# EasyEDA Pro project 毕设.eprj, board PCB1
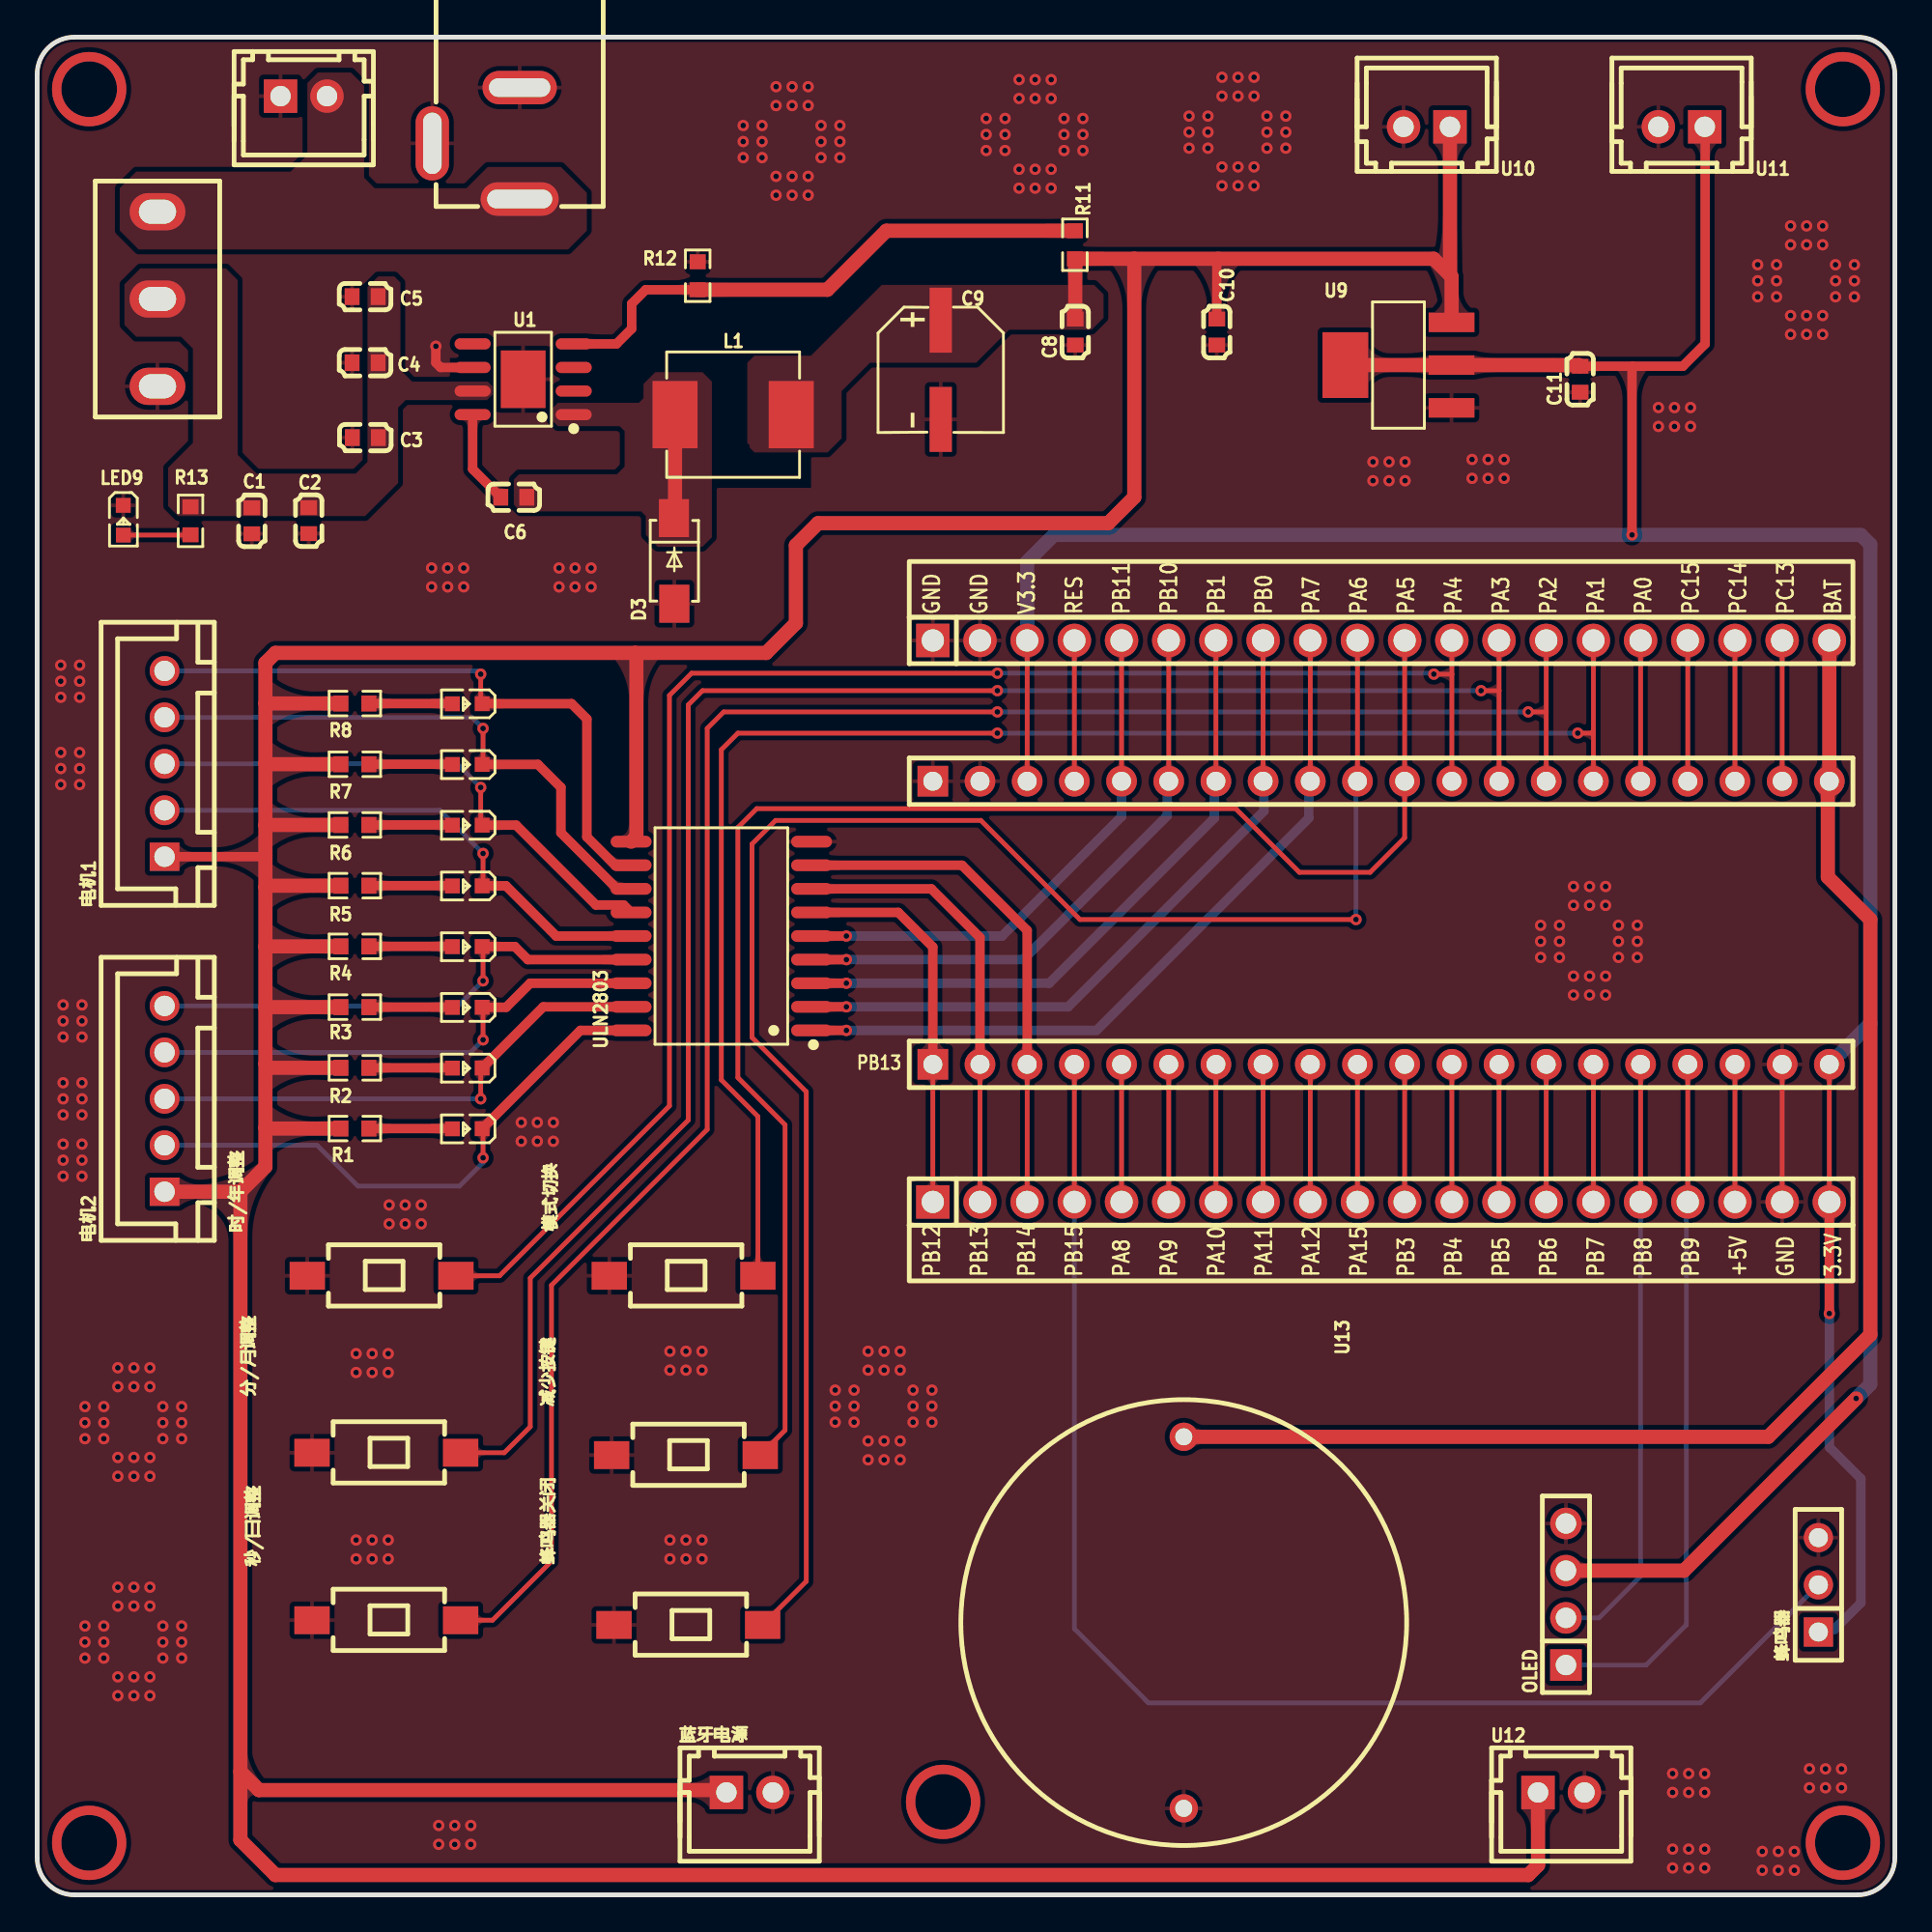
[diagram p1: board, top side]
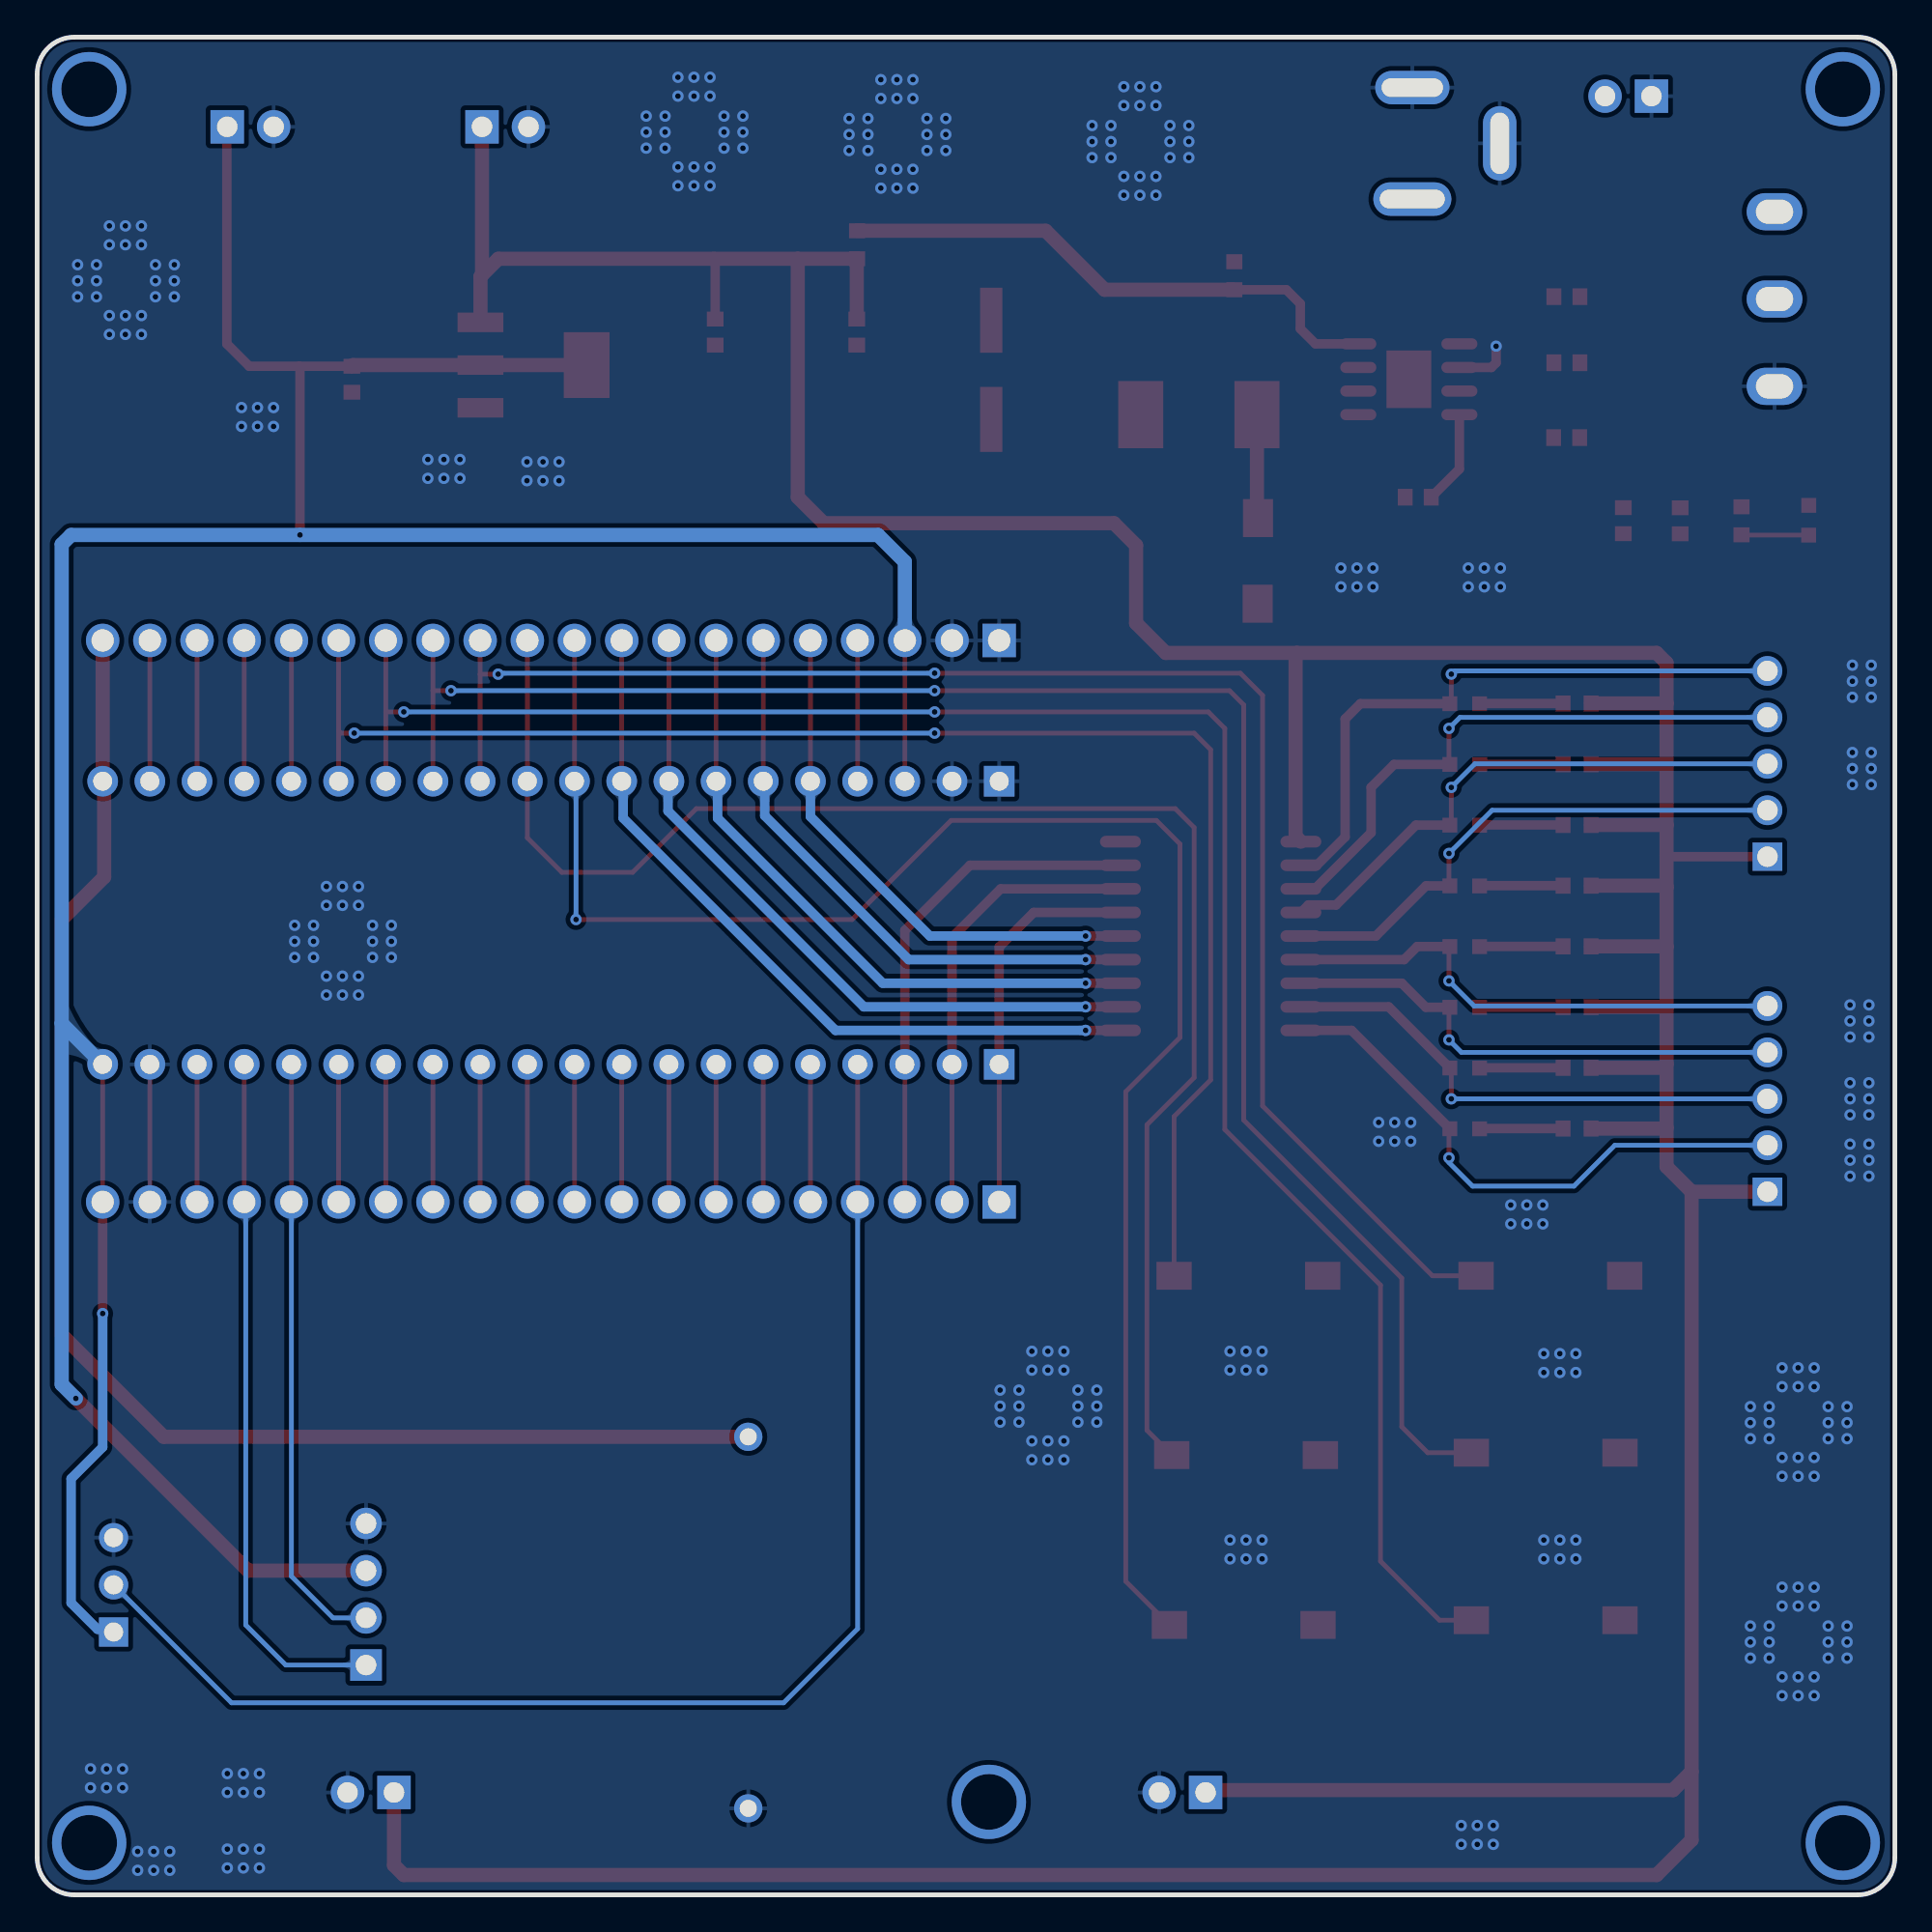
[diagram p2: board, bottom side, seen from below]

Outline 100 x 100 mm; copper layers: Top Layer, Bottom Layer. Coordinates in mm from the lower left corner of the outline.
Outline path: 0,98 0,2 arc(0.59,0.59) 2,0 98,0 arc(99.41,0.59) 100,2 100,98 arc(99.41,99.41) 98,100 2,100 arc(0.59,99.41) 0,98
Stack: Top Layer 0.035mm / Dielectric1 1.51mm FR4 er 4.5 / Bottom Layer 0.035mm

## Design rules (mm)
template: JLCPCB Capability(Two Layers Board)
spacing copperThickness1oz (default): track to track 0.102, other pairs 0.152 to 0.3
spacing copperThickness2oz: track to track 0.203, other pairs 0.152 to 0.3
track width copperThickness1oz (default): min 0.127, default 0.254, max 2.54
track width copperThickness2oz: min 0.203, default 0.254, max 2.54
differential pair differentialPair (default): width min 0.127, default 0.254, max 2.54; gap min 0.152, default 0.152
via viaSize (default): diameter min 0.5, default 0.61, max 10; hole min 0.3, default 0.305, max 6.3

## Placement (name value [footprint] x y rotation side)
C1  100nF  [C0603]  11.56 73.97 270 top
C2  100nF  [C0603]  14.62 73.97 270 top
C3  4.7μF  [C0603]  17.67 78.44 0 top
C4  4.7μF  [C0603]  17.65 82.47 0 top
C5  0.01μF  [C0603]  17.65 86.03 0 top
C6  0.01μF  [C0603]  25.66 75.23 0 top
C8  0.01μF  [C0603]  55.88 84.12 90 top
C9  330uF  [CAP-SMD_BD6.3-L6.6-W6.6-LS7.3-FD]  48.64 82.09 270 top
C10  10μF  [C0603]  63.5 84.12 270 top
C11  10μF  [C0603]  83.06 81.58 90 top
CN1  ZX-XH2.54-2PZZ  [CONN-TH_2P-P2.50_HX25003-2A]  14.35 96.83 0 top
D3  SS54  [SMA_L4.3-W2.6-LS5.0-FD]  34.29 71.81 90 top
DC1  DC-005-5A-2.0  [DC-IN-TH_DC-005-5A-2.0]  23.62 94.28 270 top
H2  -  [HDR-TH_20P-P2.54-V-M-1]  72.34 37.3 0 top
H3  -  [HDR-TH_20P-P2.54-V-M-1]  72.34 67.53 0 top
L1  15uH  [IND-SMD_L7.0-W6.6_FXL0630]  37.47 79.68 180 top
LED1  -  [LED_0603]  23.1 41.23 180 top
LED2  -  [LED_0603]  23.1 44.5 180 top
LED3  -  [LED_0603]  23.1 47.77 180 top
LED4  -  [LED_0603]  23.1 51.04 180 top
LED5  -  [LED_0603]  23.1 54.3 180 top
LED6  -  [LED_0603]  23.1 57.57 180 top
LED7  -  [LED_0603]  23.1 60.84 180 top
LED8  -  [LED_0603]  23.1 64.11 180 top
LED9  -  [LED_0603]  4.64 73.95 270 top
OLED  -  [HDR-TH_4P-P2.54-V-F]  82.3 16.18 90 top
R1  10K  [R0603]  17.1 41.25 180 top
R2  10K  [R0603]  17.1 44.52 180 top
R3  10K  [R0603]  17.1 47.79 180 top
R4  10K  [R0603]  17.1 51.06 180 top
R5  10K  [R0603]  17.1 54.32 180 top
R6  10K  [R0603]  17.1 57.59 180 top
R7  10K  [R0603]  17.1 60.86 180 top
R8  10K  [R0603]  17.1 64.13 180 top
R11  10K  [R0603]  55.86 88.82 270 top
R12  3KΩ  [R0603]  35.56 87.16 270 top
R13  10K  [R0603]  8.25 73.97 90 top
SW1  SS-12D10L5  [SW-TH_SS-12D10L5]  6.48 85.9 90 top
U1  TPS5450QDDARQ1  [SOIC-8_L4.9-W3.9-P1.27-LS6.0-BL-EP]  26.16 81.58 90 top
U7  PM254-1-20-Z-8.5  [HDR-TH_20P-P2.54-V-F-2]  72.34 44.71 0 top
U8  PM254-1-20-Z-8.5  [HDR-TH_20P-P2.54-V-F-2]  72.34 59.95 0 top
U9  LM1117IMPX-3.3/NOPB  [SOT-223_L6.5-W3.5-P2.30-LS7.0-BR]  73.28 82.35 0 top
U10  ZX-XH2.54-2PZZ  [CONN-TH_2P-P2.50_HX25003-2A]  74.8 95.17 180 top
U11  ZX-XH2.54-2PZZ  [CONN-TH_2P-P2.50_HX25003-2A]  88.52 95.17 180 top
U12  ZX-XH2.54-2PZZ  [CONN-TH_2P-P2.50_HX25003-2A]  82.04 5.51 0 top
U13  -  [纽扣]  61.72 14.66 270 top
ULN2803  ULN2803  [SOP-18_L11.6-W7.5-P1.27-LS10.3-BL]  36.83 51.61 90 top
减少按键  TS-1101-C-W  [SW-SMD_L6.0-W3.3-LS8.0]  34.93 23.67 180 top
分/月调整  TS-1101-C-W  [SW-SMD_L6.0-W3.3-LS8.0]  18.8 23.8 180 top
时/年调整  TS-1101-C-W  [SW-SMD_L6.0-W3.3-LS8.0]  18.54 33.33 180 top
模式切换  TS-1101-C-W  [SW-SMD_L6.0-W3.3-LS8.0]  34.8 33.33 180 top
电机1  电机1  [CONN-TH_5P-P2.50_ZX-XH2.54-5PZZ]  6.86 60.88 90 top
电机2  电机2  [CONN-TH_5P-P2.50_ZX-XH2.54-5PZZ]  6.86 42.85 90 top
秒/日调整  TS-1101-C-W  [SW-SMD_L6.0-W3.3-LS8.0]  18.8 14.78 180 top
蓝牙电源  ZX-XH2.54-2PZZ  [CONN-TH_2P-P2.50_HX25003-2A]  38.35 5.51 0 top
蜂鸣器  -  [HDR-TH_3P-P2.54-V-F]  95.88 16.69 90 top
蜂鸣器关闭  TS-1101-C-W  [SW-SMD_L6.0-W3.3-LS8.0]  35.05 14.53 180 top

## Footprints (pads in the part's own frame, mm; a bottom-side part is the same pattern mirrored in y, then rotated)
C0603
  rect 0.8x0.9 smd: 1(-0.7,0) 2(0.7,0)
CAP-SMD_BD6.3-L6.6-W6.6-LS7.3-FD
  rect 3.5x1.2 smd: 1(-2.67,0) 2(2.67,0)
CONN-TH_2P-P2.50_HX25003-2A
  rect 1.8x1.8 hole 1.1: 1(-1.25,0)
  round 1.8 hole 1.1: 2(1.25,0)
CONN-TH_5P-P2.50_ZX-XH2.54-5PZZ
  rect 1.524x1.6 hole 1.1: 1(-5,0)
  round 1.6 hole 1.1: 2(-2.5,0) 3(0,0) 4(2.5,0) 5(5,0)
DC-IN-TH_DC-005-5A-2.0
  oval 1.8x4.2 hole 1x3.5: 1(3,2.352)
  oval 1.8x4 hole 1x3.3: 2(-3,2.352)
  oval 4x1.8 hole 3.3x1: 3(-0.001,-2.352)
HDR-TH_3P-P2.54-V-F
  rect 1.575x1.575 hole 1.02: 1(-2.54,0)
  round 1.575 hole 1.02: 2(0,0) 3(2.54,0)
HDR-TH_4P-P2.54-V-F
  rect 1.7x1.7 hole 1.1: 1(-3.81,0)
  round 1.7 hole 1.1: 2(-1.27,0) 3(1.27,0) 4(3.81,0)
HDR-TH_20P-P2.54-V-F-2
  rect 1.65x1.65 hole 1.02: 1(-24.13,0)
  round 1.65 hole 1.02: 2(-21.59,0) 3(-19.05,0) 4(-16.51,0) 5(-13.97,0) 6(-11.43,0) 7(-8.89,0) 8(-6.35,0) 9(-3.81,0) 10(-1.27,0) 11(1.27,0) 12(3.81,0) 13(6.35,0) 14(8.89,0) 15(11.43,0) 16(13.97,0) 17(16.51,0) 18(19.05,0) 19(21.59,0) 20(24.13,0)
HDR-TH_20P-P2.54-V-M-1
  rect 1.8x1.8 hole 1.2: 1(-24.13,0)
  round 1.8 hole 1.2: 2(-21.59,0) 3(-19.05,0) 4(-16.51,0) 5(-13.97,0) 6(-11.43,0) 7(-8.89,0) 8(-6.35,0) 9(-3.81,0) 10(-1.27,0) 11(1.27,0) 12(3.81,0) 13(6.35,0) 14(8.89,0) 15(11.43,0) 16(13.97,0) 17(16.51,0) 18(19.05,0) 19(21.59,0) 20(24.13,0)
IND-SMD_L7.0-W6.6_FXL0630
  rect 2.424x3.62 smd: 1(3.128,0) 2(-3.128,0)
LED_0603
  rect 0.8x0.8 smd: 1(-0.851,-0.01) 2(0.75,-0.005)
R0603
  rect 0.806x0.864 smd: 1(-0.753,0) 2(0.753,0)
SMA_L4.3-W2.6-LS5.0-FD
  rect 2.046x1.62 smd: 1(-2.304,-0.009) 2(2.304,0.009)
SOIC-8_L4.9-W3.9-P1.27-LS6.0-BL-EP
  oval 0.602x1.941 smd: 1(-1.905,-2.72) 2(-0.635,-2.72) 3(0.635,-2.72) 4(1.905,-2.72) 5(1.905,2.72) 6(0.635,2.72) 7(-0.635,2.72) 8(-1.905,2.72)
  rect 3.098x2.41 smd: 9(0,0)
SOP-18_L11.6-W7.5-P1.27-LS10.3-BL
  oval 0.63x2.2 smd: 1(-5.08,-4.857) 2(-3.81,-4.857) 3(-2.54,-4.857) 4(-1.27,-4.857) 5(0,-4.857) 6(1.27,-4.857) 7(2.54,-4.857) 8(3.81,-4.857) 9(5.08,-4.857) 10(5.08,4.857) 11(3.81,4.857) 12(2.54,4.857) 13(1.27,4.857) 14(0,4.857) 15(-1.27,4.857) 16(-2.54,4.857) 17(-3.81,4.857) 18(-5.08,4.857)
SOT-223_L6.5-W3.5-P2.30-LS7.0-BR
  rect 2.465x1.05 smd: 1(2.857,-2.3) 2(2.857,0) 3(2.857,2.3)
  rect 2.465x3.54 smd: 4(-2.857,0)
SW-SMD_L6.0-W3.3-LS8.0
  rect 1.9x1.5 smd: 1(-4,0) 2(4,0)
SW-TH_SS-12D10L5
  oval 2x3 hole 1.3x2: 1(-4.7,0) 2(0,0) 3(4.7,0)
纽扣
  round 1.524 hole 0.914x0.85: VBAT(-10,0) VBATLOW(10,0)

## Nets
As in the schematic.

Pads without a net: U1 2 3 5

## Via types
v1: diameter 4, hole 2.999, Top Layer to Bottom Layer, 5 vias
v2: diameter 0.61, hole 0.305, Top Layer to Bottom Layer, 344 vias

## Routing (per net, layer and track width the routed paths; a pad name or vN(x,y) marks a point on that pad's centre or on a via; arc(x,y) is an arc through that point)
5V: length 7.4
  Top Layer w0.254: H2.18 U7.18
GND: length 10.4
  Top Layer w0.254: U7.19 H2.19
  Top Layer w0.508: v2(21.46,83.36) 21.46,82.47 21.72,82.22 U1.6
  vias: v2(1.27,66.19) v2(1.27,65.33) v2(1.27,64.47) v2(1.27,61.49) v2(1.27,60.63) v2(1.27,59.77) v2(1.4,47.9) v2(1.4,47.04) v2(1.4,46.18) v2(1.4,43.71) v2(1.4,42.85) v2(1.4,41.99) v2(1.4,40.41) v2(1.4,39.55) v2(1.4,38.68) v2(2.29,66.19) v2(2.29,65.33) v2(2.29,64.47) v2(2.29,61.49) v2(2.29,60.63) v2(2.29,59.77) v2(2.41,47.9) v2(2.41,47.04) v2(2.41,46.18) v2(2.41,43.71) v2(2.41,42.85) v2(2.41,41.99) v2(2.41,40.41) v2(2.41,39.55) v2(2.41,38.68) v2(2.57,26.28) v2(2.57,25.42) v2(2.57,24.56) v2(2.57,14.47) v2(2.57,13.61) v2(2.57,12.74) v2(3.59,26.28) v2(3.59,25.42) v2(3.59,24.56) v2(3.59,14.47) v2(3.59,13.61) v2(3.59,12.74) v2(4.34,28.37) v2(4.34,27.36) v2(4.34,23.55) v2(4.34,22.53) v2(4.34,16.56) v2(4.34,15.54) v2(4.34,11.74) v2(4.34,10.72) v2(5.21,28.37) v2(5.21,27.36) v2(5.21,23.55) v2(5.21,22.53) v2(5.21,16.56) v2(5.21,15.54) v2(5.21,11.74) v2(5.21,10.72) v2(6.07,28.37) v2(6.07,27.36) v2(6.07,23.55) v2(6.07,22.53) v2(6.07,16.56) v2(6.07,15.54) v2(6.07,11.74) v2(6.07,10.72) v2(6.76,26.28) v2(6.76,25.42) v2(6.76,24.56) v2(6.76,14.47) v2(6.76,13.61) v2(6.76,12.74) v2(7.78,26.28) v2(7.78,25.42) v2(7.78,24.56) v2(7.78,14.47) v2(7.78,13.61) v2(7.78,12.74) v2(17.17,29.13) v2(17.17,28.12) v2(17.17,19.1) v2(17.17,18.09) v2(18.03,29.13) v2(18.03,28.12) v2(18.03,19.1) v2(18.03,18.09) v2(18.95,37.14) v2(18.95,36.12) v2(18.9,29.13) v2(18.9,28.12) v2(18.9,19.1) v2(18.9,18.09) v2(19.81,37.14) v2(19.81,36.12) v2(20.68,37.14) v2(20.68,36.12) v2(21.23,71.42) v2(21.23,70.41) v2(21.62,3.73) v2(21.62,2.72) v2(22.1,71.42) v2(22.1,70.41) v2(22.48,3.73) v2(22.48,2.72) v2(22.96,71.42) v2(22.96,70.41) v2(23.34,3.73) v2(23.34,2.72) v2(26.06,41.58) v2(26.06,40.56) v2(26.92,41.58) v2(26.92,40.56) v2(27.79,41.58) v2(27.79,40.56) v2(28.09,71.42) v2(28.09,70.41) v2(28.96,71.42) v2(28.96,70.41) v2(29.82,71.42) v2(29.82,70.41) v2(34.06,29.26) v2(34.06,28.25) v2(34.06,19.1) v2(34.06,18.09) v2(34.93,29.26) v2(34.93,28.25) v2(34.93,19.1) v2(34.93,18.09) v2(35.79,29.26) v2(35.79,28.25) v2(35.79,19.1) v2(35.79,18.09) v2(38.01,95.24) v2(38.01,94.38) v2(38.01,93.52) v2(39.02,95.24) v2(39.02,94.38) v2(39.02,93.52) v2(39.78,97.33) v2(39.78,96.32) v2(39.78,92.51) v2(39.78,91.49) v2(40.64,97.33) v2(40.64,96.32) v2(40.64,92.51) v2(40.64,91.49) v2(41.5,97.33) v2(41.5,96.32) v2(41.5,92.51) v2(41.5,91.49) v2(42.2,95.24) v2(42.2,94.38) v2(42.2,93.52) v2(42.96,27.17) v2(42.96,26.31) v2(42.96,25.44) v2(43.21,95.24) v2(43.21,94.38) v2(43.21,93.52) v2(43.97,27.17) v2(43.97,26.31) v2(43.97,25.44) v2(44.73,29.26) v2(44.73,28.25) v2(44.73,24.44) v2(44.73,23.42) v2(45.59,29.26) v2(45.59,28.25) v2(45.59,24.44) v2(45.59,23.42) v2(46.46,29.26) v2(46.46,28.25) v2(46.46,24.44) v2(46.46,23.42) v2(47.15,27.17) v2(47.15,26.31) v2(47.15,25.44) v2(48.17,27.17) v2(48.17,26.31) v2(48.17,25.44) v2(51.09,95.62) v2(51.09,94.76) v2(51.09,93.9) v2(52.1,95.62) v2(52.1,94.76) v2(52.1,93.9) v2(52.86,97.71) v2(52.86,96.7) v2(52.86,92.89) v2(52.86,91.87) v2(53.72,97.71) v2(53.72,96.7) v2(53.72,92.89) v2(53.72,91.87) v2(54.58,97.71) v2(54.58,96.7) v2(54.58,92.89) v2(54.58,91.87) v2(55.28,95.62) v2(55.28,94.76) v2(55.28,93.9) v2(56.29,95.62) v2(56.29,94.76) v2(56.29,93.9) v2(62.01,95.75) v2(62.01,94.89) v2(62.01,94.02) v2(63.02,95.75) v2(63.02,94.89) v2(63.02,94.02) v2(63.78,97.84) v2(63.78,96.83) v2(63.78,93.02) v2(63.78,92) v2(64.64,97.84) v2(64.64,96.83) v2(64.64,93.02) v2(64.64,92) v2(65.51,97.84) v2(65.51,96.83) v2(65.51,93.02) v2(65.51,92) v2(66.2,95.75) v2(66.2,94.89) v2(66.2,94.02) v2(67.22,95.75) v2(67.22,94.89) v2(67.22,94.02) v2(71.91,77.14) v2(71.91,76.12) v2(72.77,77.14) v2(72.77,76.12) v2(73.63,77.14) v2(73.63,76.12) v2(77.24,77.27) v2(77.24,76.25) v2(78.1,77.27) v2(78.1,76.25) v2(78.97,77.27) v2(78.97,76.25) v2(80.93,52.19) v2(80.93,51.33) v2(80.93,50.46) v2(81.95,52.19) v2(81.95,51.33) v2(81.95,50.46) v2(82.7,54.28) v2(82.7,53.26) v2(82.7,49.45) v2(82.7,48.44) v2(83.57,54.28) v2(83.57,53.26) v2(83.57,49.45) v2(83.57,48.44) v2(84.43,54.28) v2(84.43,53.26) v2(84.43,49.45) v2(84.43,48.44) v2(85.12,52.19) v2(85.12,51.33) v2(85.12,50.46) v2(86.14,52.19) v2(86.14,51.33) v2(86.14,50.46) v2(87.27,80.06) v2(87.27,79.05) v2(88.04,6.53) v2(88.04,5.51) v2(88.04,2.46) v2(88.04,1.45) v2(88.14,80.06) v2(88.14,79.05) v2(88.9,6.53) v2(88.9,5.51) v2(88.9,2.46) v2(88.9,1.45) v2(89,80.06) v2(89,79.05) v2(89.76,6.53) v2(89.76,5.51) v2(89.76,2.46) v2(89.76,1.45) v2(92.62,87.75) v2(92.62,86.89) v2(92.62,86.02) v2(92.86,2.34) v2(92.86,1.32) v2(93.63,87.75) v2(93.63,86.89) v2(93.63,86.02) v2(93.73,2.34) v2(93.73,1.32) v2(94.39,89.84) v2(94.39,88.82) v2(94.39,85.01) v2(94.39,84) v2(94.59,2.34) v2(94.59,1.32) v2(95.25,89.84) v2(95.25,88.82) v2(95.25,85.01) v2(95.25,84) v2(95.4,6.78) v2(95.4,5.77) v2(96.11,89.84) v2(96.11,88.82) v2(96.11,85.01) v2(96.11,84) v2(96.27,6.78) v2(96.27,5.77) v2(96.81,87.75) v2(96.81,86.89) v2(96.81,86.02) v2(97.13,6.78) v2(97.13,5.77) v2(97.82,87.75) v2(97.82,86.89) v2(97.82,86.02)
VBAT: length 77.6
  Top Layer w0.762: U13.VBAT 93.19,24.66 98.68,30.15 98.68,52.5 96.39,54.79 96.39,59.87 U8.20 H3.20
VCC+3.3V: length 200.2
  Top Layer w0.254: H3.3 U8.3 ; H2.20 U7.20
  Top Layer w0.508: C11.2 85.9,82.28 ; 85.9,82.28 88.58,82.28 89.79,83.49 89.79,95.15 U11.1 ; 85.9,82.28 85.85,82.24 v2(85.85,73.2) ; H2.20 v2(96.47,31.29)
  Top Layer w0.762: v2(97.92,26.72) 88.65,17.45 OLED.3 ; U9.4 U9.2 83,82.35 C11.2
  Bottom Layer w0.508: v2(96.47,31.29) 96.47,24.1 98.17,22.4 98.17,15.72 96.75,14.3 96.03,14.3 蜂鸣器.1
  Bottom Layer w0.762: v2(97.92,26.72) 98.68,27.48 98.68,46.91 ; 98.68,46.91 98.68,72.69 98.17,73.2 v2(85.85,73.2) 54.74,73.2 53.29,71.76 H3.3 ; 98.68,46.91 U7.20
VCC+5V: length 321.2
  Top Layer w0.508: 63.57,88.07 63.5,88 C10.1 ; 12.29,55.97 12.21,55.88 电机1.1
  Top Layer w0.762: 12.29,64.13 12.29,60.91 ; 12.29,64.13 16.35,64.13 16.35,64.13 ; 12.29,64.13 12.29,66.31 12.83,66.85 32.18,66.85 ; 12.29,60.91 12.29,57.58 ; 12.29,60.91 12.34,60.86 16.35,60.86 ; 32.18,66.85 32.26,66.78 32.26,56.98 ULN2803.10 ; 32.18,66.85 39.24,66.85 40.84,68.45 40.84,72.64 42.04,73.84 57.66,73.84 59.06,75.24 59.06,88.07 ; 59.06,88.07 75.18,88.07 76.05,87.19 ; 59.06,88.07 R11.2 55.88,88.05 C8.2 ; 12.29,41.29 12.29,39.2 10.94,37.85 ; 12.29,41.29 12.29,44.73 ; 12.29,41.29 12.33,41.25 16.35,41.25 ; 16.35,47.79 12.31,47.79 12.29,47.77 ; 12.29,51.05 12.3,51.06 16.35,51.06 ; 12.29,51.05 12.29,47.77 ; 12.29,51.05 12.29,54.25 ; U12.1 80.79,1.59 80.26,1.07 12.83,1.07 10.94,2.95 10.94,6.64 ; 76.05,87.19 76.14,87.11 76.14,84.65 ; 76.05,87.19 U10.1 ; 12.29,44.73 12.29,47.77 ; 12.29,44.73 12.5,44.52 16.35,44.52 ; 10.94,37.85 10.94,6.64 ; 10.94,37.85 电机2.1 ; 10.94,6.64 11.94,5.64 36.98,5.64 蓝牙电源.1 ; 12.29,57.58 12.29,54.25 ; 12.29,57.58 12.3,57.59 16.35,57.59 ; 12.29,54.25 12.36,54.32 16.35,54.32
(no net):
  vias: v1(2.8,97.2) v1(2.8,2.8) v1(48.77,5) v1(97.2,97.2) v1(97.2,2.8)
1C: length 30.6
  Top Layer w0.254: v2(24,39.67) 24,41.19 LED1.1
  Top Layer w0.508: LED1.1 29.25,46.53 ULN2803.18
  Bottom Layer w0.254: v2(24,39.67) 24,39.42 22.73,38.15 17.27,38.15 15.07,40.35 电机2.2
2C: length 28
  Top Layer w0.254: v2(23.88,42.85) 23.88,44.43
  Top Layer w0.508: LED2.1 27.25,47.8 ULN2803.17
  Bottom Layer w0.254: 电机2.3 v2(23.88,42.85)
3C: length 27.8
  Top Layer w0.254: v2(24,46.03) 24,47.73 LED3.1
  Top Layer w0.508: ULN2803.16 26.54,49.07 25.25,47.78 LED3.1
  Bottom Layer w0.254: v2(24,46.03) 23.33,45.35 电机2.4
4C: length 27.9
  Top Layer w0.254: LED4.1 24,51 v2(24,49.2)
  Top Layer w0.508: ULN2803.15 26.42,50.34 25.71,51.05 LED4.1
  Bottom Layer w0.254: 电机2.5 22.65,47.85 v2(24,49.2)
5C: length 29
  Top Layer w0.254: LED5.1 24,54.36 v2(24,56.06)
  Top Layer w0.508: LED5.1 25.24,54.31 27.94,51.61 ULN2803.14
  Bottom Layer w0.254: 电机1.2 21.68,58.38 v2(24,56.06)
6C: length 29.6
  Top Layer w0.254: 23.95,57.58 23.88,57.66 v2(23.88,59.61)
  Top Layer w0.508: 23.95,57.58 25.78,57.58 30.08,53.28 31.57,53.28 ULN2803.13
  Bottom Layer w0.254: v2(23.88,59.61) 22.61,60.88 电机1.3
7C: length 31.6
  Top Layer w0.254: v2(24,62.79) 24,60.9 LED7.1
  Top Layer w0.508: ULN2803.12 31.22,54.15 28.19,57.18 28.19,59.61 26.96,60.85 LED7.1
  Bottom Layer w0.254: v2(24,62.79) 23.41,63.38 电机1.4
8C: length 34.1
  Top Layer w0.254: v2(23.88,65.71) 23.88,64.2 LED8.1
  Top Layer w0.508: ULN2803.11 31.12,55.42 29.59,56.95 29.59,63.3 28.77,64.12 LED8.1
  Bottom Layer w0.254: 电机1.5 23.7,65.88 v2(23.88,65.71)
PA0: length 7.6
  Top Layer w0.254: U8.16 H3.16
PA1: length 84.1
  Top Layer w0.254: 83.77,62.66 83.65,62.53 v2(82.93,62.53) ; 83.77,62.66 H3.15 ; 83.77,62.66 U8.15 ; v2(51.69,62.53) 37.72,62.53 36.83,61.65 36.83,43.87 38.8,41.9 模式切换.1
  Bottom Layer w0.254: v2(51.69,62.53) v2(82.93,62.53)
PA2: length 107.7
  Top Layer w0.254: 81.23,63.66 H3.14 ; 81.23,63.66 U8.14 ; 81.23,63.66 81.22,63.68 v2(80.26,63.68) ; v2(51.69,63.68) 36.96,63.68 36.07,62.79 36.07,41.2 27.69,32.82 27.69,17.96 24.51,14.78 秒/日调整.1
  Bottom Layer w0.254: 81.28,59.9 U8.14 ; v2(51.69,63.68) v2(80.26,63.68)
PA3: length 98.2
  Top Layer w0.254: 分/月调整.1 25.15,23.8 26.54,25.2 26.54,33.2 35.05,41.71 35.05,64.06 35.81,64.82 v2(51.69,64.82) ; H3.13 78.69,64.83 ; 78.69,64.83 78.69,64.82 v2(77.72,64.82) ; 78.69,64.83 U8.13
  Bottom Layer w0.254: v2(51.69,64.82) v2(77.72,64.82)
PA4: length 87.6
  Top Layer w0.254: 76.15,65.7 76.14,65.71 v2(75.18,65.71) ; 76.15,65.7 U8.12 ; 76.15,65.7 H3.12 ; 时/年调整.1 24.89,33.33 34.04,42.47 34.04,64.57 35.23,65.76 v2(51.69,65.76)
  Bottom Layer w0.254: v2(51.69,65.76) 75.13,65.76 v2(75.18,65.71)
PA5: length 84.5
  Top Layer w0.254: H3.11 U8.11 73.61,56.9 71.75,55.04 67.94,55.04 64.52,58.47 38.74,58.47 37.72,57.45 37.72,43.99 40.26,41.45 40.26,25.01 减少按键.1
PA6: length 94.5
  Top Layer w0.254: v2(70.99,52.5) 56.13,52.5 50.8,57.84 39.75,57.84 38.48,56.57 38.48,46.15 41.4,43.23 41.4,16.88 蜂鸣器关闭.1 ; U8.10 H3.10
  Bottom Layer w0.254: v2(70.99,52.5) 70.99,59.87 U8.10
PA7: length 41.1
  Top Layer w0.254: H3.9 U8.9
  Top Layer w0.508: ULN2803.1 v2(43.56,46.53)
  Bottom Layer w0.508: v2(43.56,46.53) 57.02,46.53 68.45,57.96 68.45,59.87 U8.9
PA8: length 7.5
  Top Layer w0.254: U7.5 H2.5
  Bottom Layer w0.254: 58.42,37.25 H2.5
PA9: length 7.4
  Top Layer w0.254: H2.6 U7.6
PA10: length 7.4
  Top Layer w0.254: U7.7 H2.7
PA11: length 7.4
  Top Layer w0.254: H2.8 U7.8
PA12: length 7.4
  Top Layer w0.254: U7.9 H2.9
PA15: length 7.4
  Top Layer w0.254: H2.10 U7.10
PB0: length 37.9
  Top Layer w0.254: U8.8 H3.8
  Top Layer w0.508: ULN2803.2 v2(43.56,47.8)
  Bottom Layer w0.508: v2(43.56,47.8) 55.5,47.8 66.04,58.34 66.04,59.9 U8.8
PB1: length 35
  Top Layer w0.254: H3.7 U8.7
  Top Layer w0.508: ULN2803.3 v2(43.56,49.07)
  Bottom Layer w0.508: U8.7 63.37,59.87 63.37,57.96 54.48,49.07 v2(43.56,49.07)
PB3: length 7.4
  Top Layer w0.254: U7.11 H2.11
PB4: length 7.4
  Top Layer w0.254: H2.12 U7.12
PB5: length 7.4
  Top Layer w0.254: U7.13 H2.13
PB6: length 7.4
  Top Layer w0.254: H2.14 U7.14
PB7: length 7.4
  Top Layer w0.254: U7.15 H2.15
PB8: length 32.5
  Top Layer w0.254: H2.16 U7.16
  Bottom Layer w0.254: OLED.2 84.07,14.91 86.31,17.15 H2.16
PB9: length 37.6
  Top Layer w0.254: U7.17 H2.17
  Bottom Layer w0.254: OLED.1 86.61,12.37 88.77,14.53 88.77,37.22 H2.17
PB10: length 31.8
  Top Layer w0.254: U8.6 H3.6
  Top Layer w0.508: ULN2803.4 v2(43.56,50.34)
  Bottom Layer w0.508: v2(43.56,50.34) 53.09,50.34 60.83,58.09 60.83,59.87 U8.6
PB11: length 28.8
  Top Layer w0.254: H3.5 U8.5
  Top Layer w0.508: ULN2803.5 v2(43.56,51.61)
  Bottom Layer w0.508: v2(43.56,51.61) 51.94,51.61 58.37,58.04 U8.5
PB12: length 21
  Top Layer w0.254: U7.1 H2.1
  Top Layer w0.508: U7.1 48.21,51.02 46.35,52.88 ULN2803.6
PB13: length 24.4
  Top Layer w0.254: H2.2 U7.2
  Top Layer w0.508: U7.2 50.75,51.53 48.13,54.15 ULN2803.7
PB14: length 27.7
  Top Layer w0.254: U7.3 H2.3
  Top Layer w0.508: ULN2803.8 49.78,55.42 53.29,51.91 U7.3
PB15: length 74.7
  Top Layer w0.254: H2.4 U7.4
  Bottom Layer w0.254: 蜂鸣器.2 89.53,10.34 59.82,10.34 55.83,14.32 H2.4
PC13: length 7.6
  Top Layer w0.254: H3.19 U8.19
PC14: length 7.6
  Top Layer w0.254: U8.18 H3.18
PC15: length 7.6
  Top Layer w0.254: H3.17 U8.17
RES: length 7.6
  Top Layer w0.254: U8.4 H3.4
$1N3478: length 4.5
  Top Layer w0.508: R1.1 22.34,41.25 22.35,41.24
$1N3503: length 4.5
  Top Layer w0.508: R2.1 22.34,44.52 22.35,44.5
$1N3528: length 4.5
  Top Layer w0.508: 22.35,47.77 22.34,47.79 R3.1
$1N3553: length 4.5
  Top Layer w0.508: R4.1 22.34,51.06 22.35,51.04
$1N3578: length 4.5
  Top Layer w0.508: R5.1 22.34,54.32 22.35,54.31
$1N3603: length 4.5
  Top Layer w0.508: R6.1 22.34,57.59 22.35,57.58
$1N3628: length 4.5
  Top Layer w0.508: 22.35,60.85 22.34,60.86 R7.1
$1N3653: length 4.5
  Top Layer w0.508: R8.1 22.34,64.13 22.35,64.11
$1N15282: length 30.3
  Top Layer w0.508: 35.56,86.4 32.76,86.4 32,85.65 32,84.31 31.19,83.49 U1.4
  Top Layer w0.762: 35.56,86.4 42.54,86.4 45.71,89.58 R11.1
$1N15283: length 3.6
  Top Layer w0.254: R13.1 8.24,73.2 LED9.2
$1N18661: length 5.1
  Top Layer w0.508: C6.1 23.44,76.75 U1.8
$1N18699: length 5.6
  Top Layer w0.762: D3.2 34.34,74.17 L1.1

## Copper pours and planes (outline as drawn; the poured copper is in the pictures)
GND on Top Layer: -10.41,104.95 115.57,104.95 115.57,-7.06 -10.41,-7.06
GND on Bottom Layer: -16.38,111.81 126.62,111.81 126.62,-19.63 -16.38,-19.63
VCC12V on Top Layer: 4.7,87.55 24.51,87.55 24.51,74.22 4.7,74.22
VCC+5V on Top Layer: 38.23,86.67 57.4,86.67 57.4,77.65 38.23,77.65
VIN on Top Layer: 4.44,98.09 29.59,98.09 29.59,88.57 4.44,88.57
$1N18699 on Top Layer: 25.66,81.97 36.32,81.97 36.32,72.57 25.66,72.57

Small or netless copper shapes (teardrops, artwork), in the pictures only: 218 on Top Layer, 47 on Bottom Layer

## Text on the board
Top Silkscreen Layer: PB13 | GND | PB12 | V3.3 | PB14 | RES | PB15 | PB11 | PA8 | PB10 | PA9 | PB1 | PA10 | PB0 | PA11 | PA7 | PA12 | PA6 | PA15 | PA5 | PB3 | PA4 | PB4 | PA3 | PB5 | PA2 | PB6 | PA1 | PB7 | PA0 | PB8 | PC15 | PB9 | PC14 | +5V | PC13 | BAT | 3.3V
